# EasyEDA schematic SCH_Claysight-MK1.json
TITLE: ClaySight ProtoType; REV: 1.0; Date: 2023-05-10; Sheet: 1/1; Company: The Ohio State University
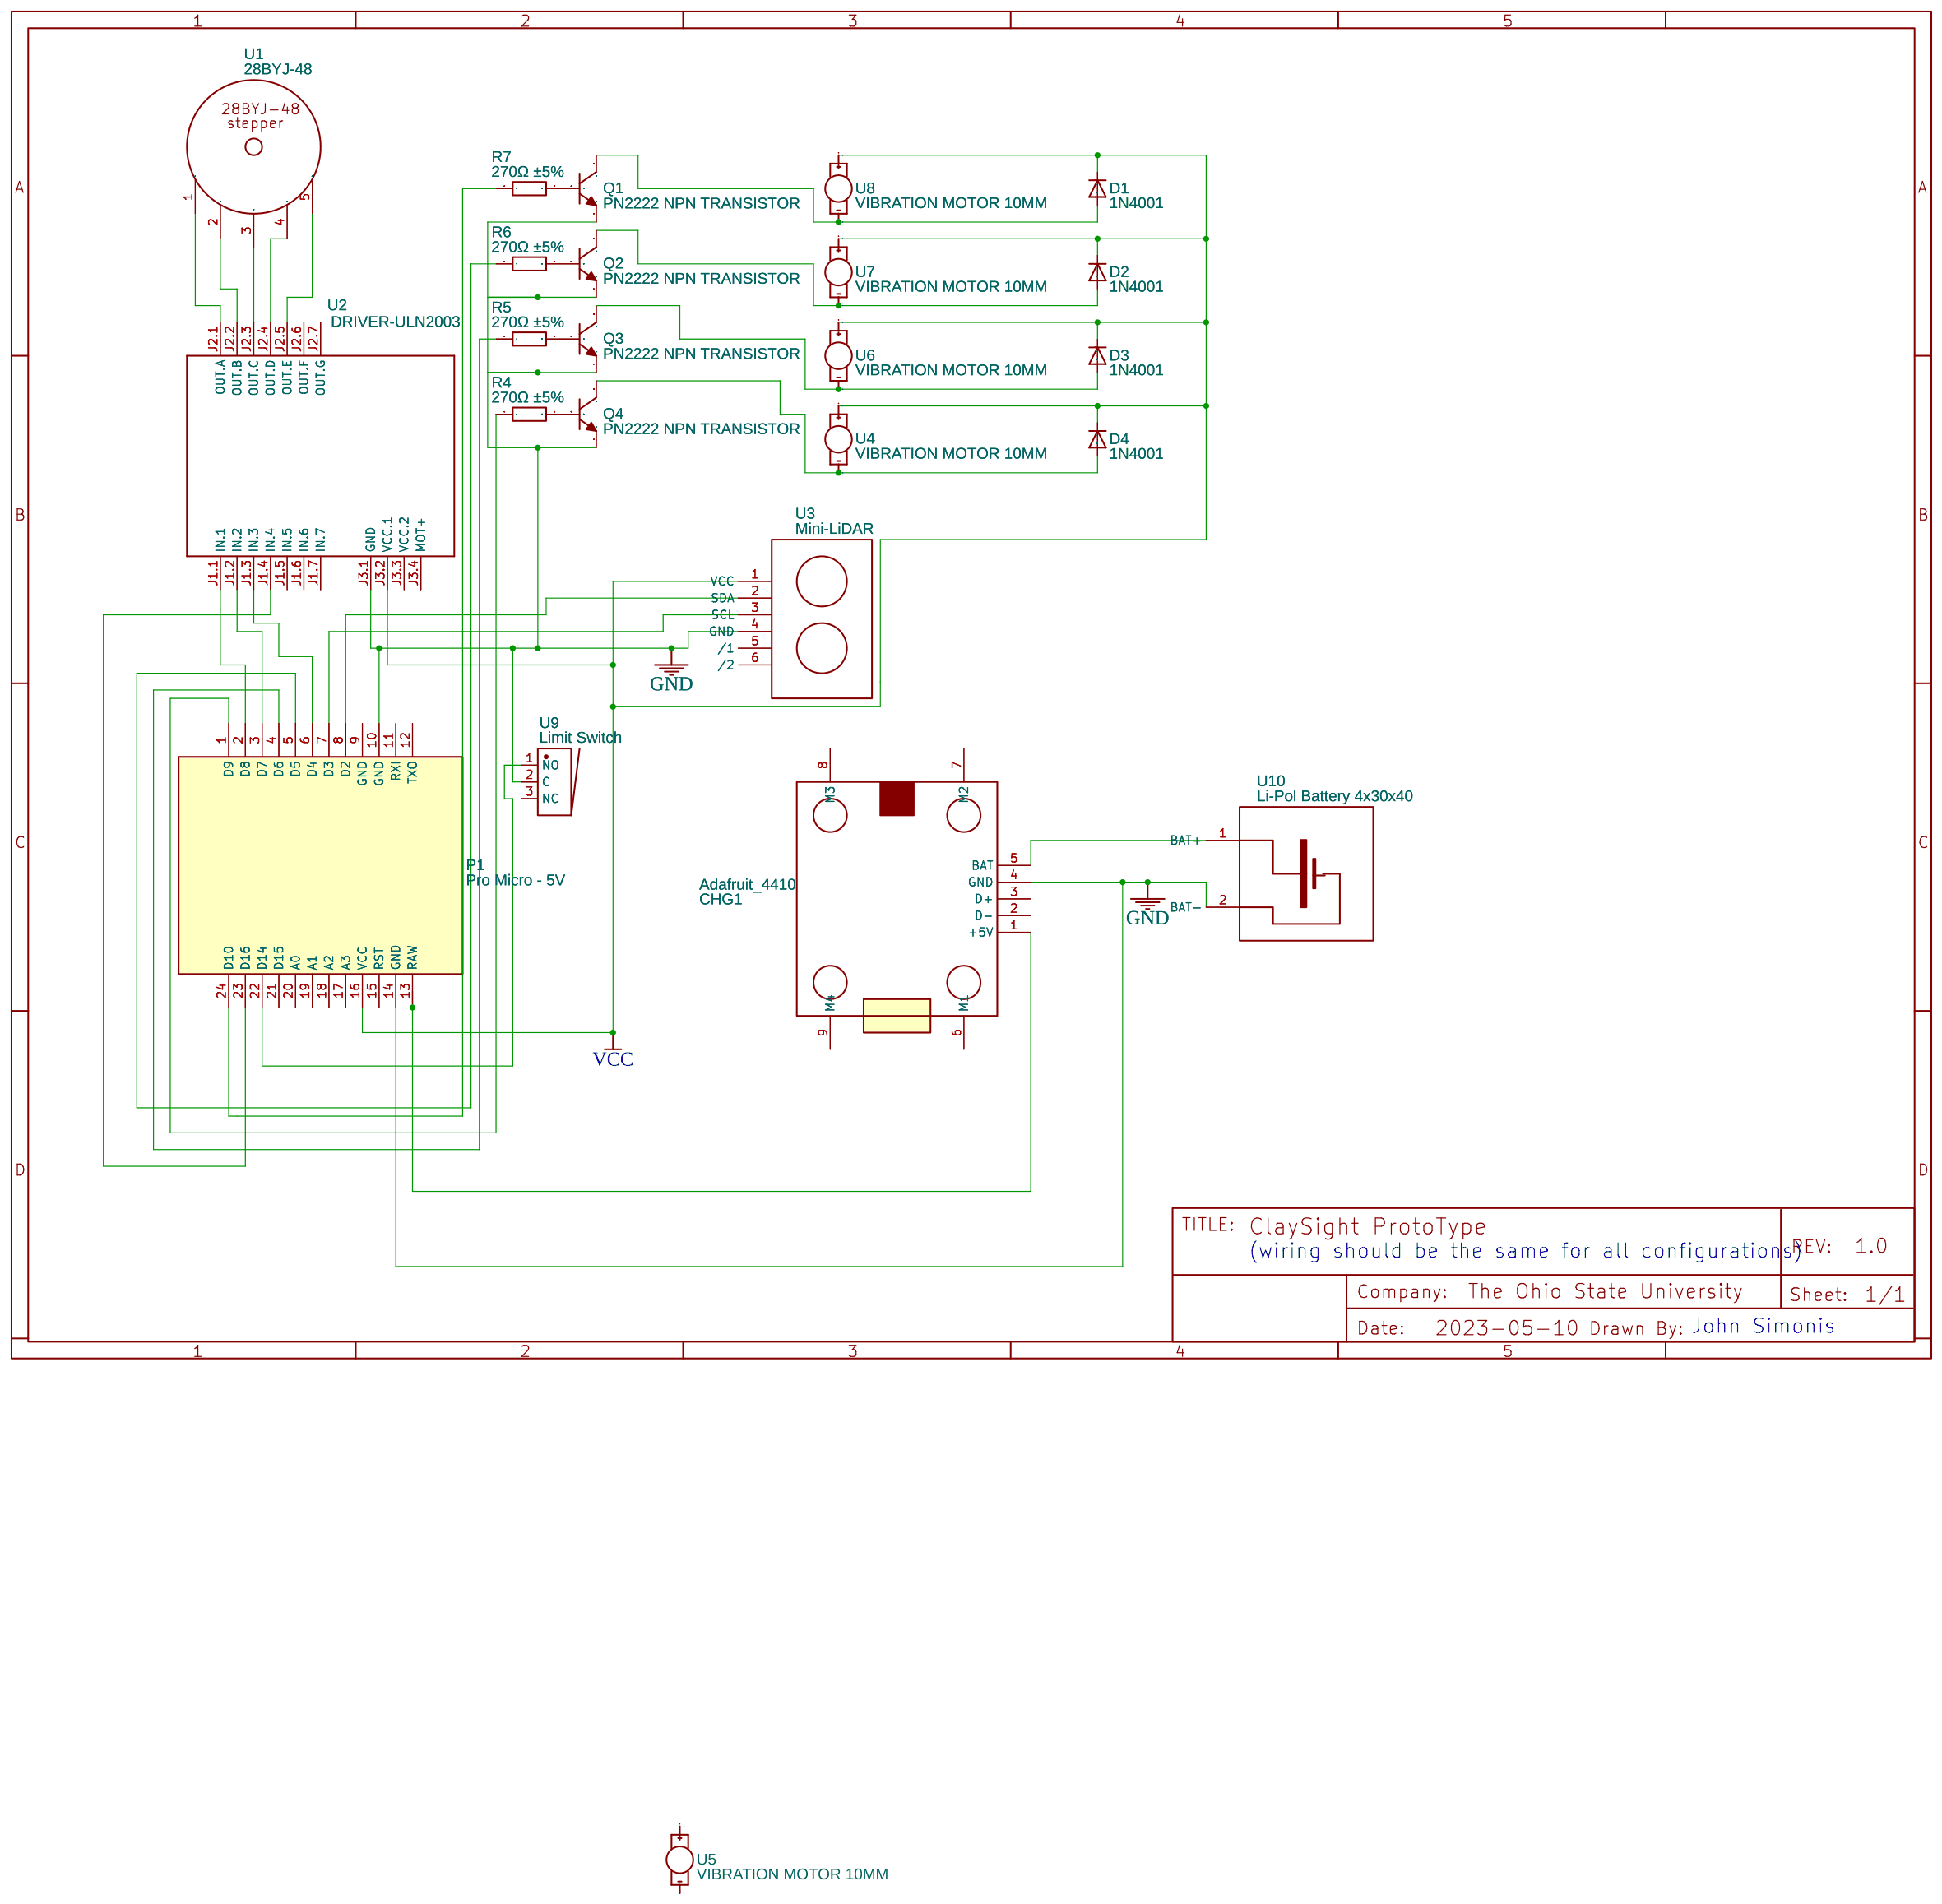
[diagram p0: schematic sheet]

## Parts
CHG1  Adafruit_4410  [ADAFRUIT_4410]
D1  1N4001  [DIODE-1N4001]
D2  1N4001  [DIODE-1N4001]
D3  1N4001  [DIODE-1N4001]
D4  1N4001  [DIODE-1N4001]
P1  Pro Micro - 5V  [PRO MICRO - 5V]
Q1  PN2222 NPN TRANSISTOR  [PN2222]
Q2  PN2222 NPN TRANSISTOR  [PN2222]
Q3  PN2222 NPN TRANSISTOR  [PN2222]
Q4  PN2222 NPN TRANSISTOR  [PN2222]
R4  270Ω ±5%  [AXIAL-20W]
R5  270Ω ±5%  [AXIAL-20W]
R6  270Ω ±5%  [AXIAL-20W]
R7  270Ω ±5%  [AXIAL-20W]
U1  28BYJ-48  [ULN2003 STEPPER MOTOR DRIVER WITH 28BYJ-48]
U2  DRIVER-ULN2003  [DRIVER-ULN2003]
U3  Mini-LiDAR  [TF LUNA LIDAR]
U4  VIBRATION MOTOR 10MM  [VIBRATION-MOTOR-10MM]
U5  VIBRATION MOTOR 10MM  [VIBRATION-MOTOR-10MM]
U6  VIBRATION MOTOR 10MM  [VIBRATION-MOTOR-10MM]
U7  VIBRATION MOTOR 10MM  [VIBRATION-MOTOR-10MM]
U8  VIBRATION MOTOR 10MM  [VIBRATION-MOTOR-10MM]
U9  Limit Switch  [LIMIT SWITCH]
U10  Li-Pol Battery 4x30x40  [LI-POL-BATTERY-4X30X40]

## Library data of the parts
CHG1 = Adafruit_4410: Manufacturer: Adafruit Industries LLC; Manufacturer Part: 4410; Supplier: Digi-Key; Supplier Part: 1528-4410-ND; link: https://www.digikey.com/en/products/detail/adafruit-industries-llc/4410/10673110; Contributor: MWalterman
D1-D4 = 1N4001: Contributor: SparkFun
P1 = Pro Micro - 5V: sourceId: 1T5FDZYC8
Q1-Q4 = PN2222 NPN TRANSISTOR: Supplier: LCSC; Supplier Part: C713605; Manufacturer: LGE; Manufacturer Part: 2N3904; Contributor: TomPilot; JLCPCB Part Class: Extended Part
R4-R7 = 270Ω ±5% 20W: Supplier Part: undefined; Supplier: LCSC; Manufacturer: ReliaPro
U1 = 28BYJ-48: sourceId: BMGYgyQK2; Contributor: MarkFlickers
U2 = DRIVER-ULN2003: 7-Channel Darlington NPN Transistor Module based on ULN2003 chip
U3 = TF Luna LiDAR: Supplier: Benewake; Contributor: michalmaniak2000
U4-U8 = VIBRATION MOTOR 10MM: Vibration Motor- ROB-08449; Contributor: SparkFun
U9 = Limit Switch: Contributor: ray johnson
U10 = Li-Pol Battery 4x30x40: Manufacturer Part: 540-563; Contributor: vaclavm; Supplier Part: 540-563; Supplier: GME; link: https://www.gme.cz/li-pol-akumulator-3-7v-400mah-4x30x35mm

## Nets
GND: CHG1.4(GND) P1.10(GND) P1.14(GND) Q1.1(E) Q2.1(E) Q3.1(E) Q4.1(E) U2.J3.1(GND) U9.2(C)
VCC: D1.C D2.C D3.C D4.C P1.16(VCC) U2.J3.2(VCC.1) U4.+ U6.+ U7.+ U8.+
Net-(CHG1-1): CHG1.1(+5V) P1.13(RAW)
Net-(D1-A): D1.A Q1.3(C) U8.-
Net-(D2-A): D2.A Q2.3(C) U7.-
Net-(D3-A): D3.A Q3.3(C) U6.-
Net-(D4-A): D4.A Q4.3(C) U4.-
Net-(P1-1): P1.1(D9) R4.1
Net-(P1-2): P1.2(D8) U2.J1.1(IN.1)
Net-(P1-3): P1.3(D7) U2.J1.2(IN.2)
Net-(P1-4): P1.4(D6) R5.1
Net-(P1-5): P1.5(D5) R6.1
Net-(P1-6): P1.6(D4) U2.J1.3(IN.3)
Net-(P1-22): P1.22(D14) U9.1(NO)
Net-(P1-23): P1.23(D16) U2.J1.4(IN.4)
Net-(P1-24): P1.24(D10) R7.1
Net-(Q1-2): Q1.2(B) R7.2
Net-(Q2-2): Q2.2(B) R6.2
Net-(Q3-2): Q3.2(B) R5.2
Net-(Q4-2): Q4.2(B) R4.2
Net-(U1-1): U1.1 U2.J2.1(OUT.A)
Net-(U1-2): U1.2 U2.J2.2(OUT.B)
Net-(U1-3): U1.3 U2.J2.3(OUT.C)
Net-(U1-4): U1.4 U2.J2.4(OUT.D)
Net-(U1-5): U1.5 U2.J2.5(OUT.E)

Not connected (* = marked no-connect by the designer): CHG1 2(D-) 3(D+) 5(BAT) 6(M1) 7(M2) 8(M3) 9(M4); P1 7(D3) 8(D2) 9(GND) 11(RXI) 12(TXO) 15(RST) 17(A3) 18(A2) 19(A1) 20(A0) 21(D15); U2 J1.5(IN.5) J1.6(IN.6) J1.7(IN.7) J2.6(OUT.F) J2.7(OUT.G) J3.3(VCC.2) J3.4(MOT+); U3 1(VCC) 2(SDA) 3(SCL) 4(GND) 5(/1) 6(/2); U5 + -; U9 3(NC); U10 1(BAT+) 2(BAT-)

## Notes on the sheet
- (wiring should be the same for all configurations)
- John Simonis
